# EAGLE design omni-ultra-l1 (EAGLE 9.1.3)
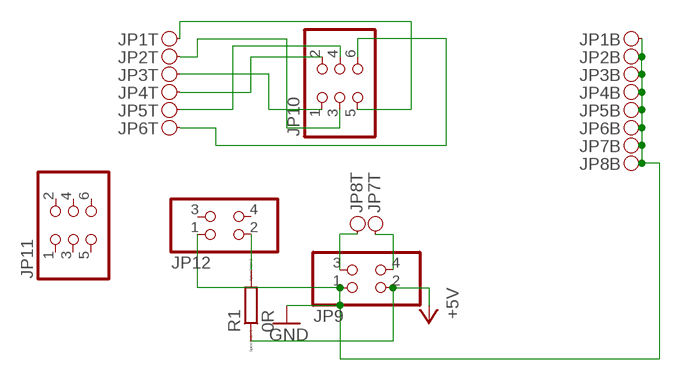
[diagram p0: schematic, sheet 1]

## Parts
JP1  PINH2X01  [PINH2X01SMD]
JP2  PINH2X01  [PINH2X01SMD]
JP3  PINH2X01  [PINH2X01SMD]
JP4  PINH2X01  [PINH2X01SMD]
JP5  PINH2X01  [PINH2X01SMD]
JP6  PINH2X01  [PINH2X01SMD]
JP7  PINH2X01  [PINH2X01SMD]
JP8  PINH2X01  [PINH2X01SMD]
JP9  PINHD-2X2  [2X02]
JP10  PINHD-2X3  [2X03]
JP11  PINHD-2X3  [2X03]
JP12  PINHD-2X2  [2X02]
R1  0R  RR1206  [R1206]

## Nets
+5V: JP9.2 R1.1
GND: JP1.B1 JP2.B1 JP3.B1 JP4.B1 JP5.B1 JP6.B1 JP7.B1 JP8.B1 JP9.1 JP12.1
N$1: JP3.T1 JP10.1
N$2: JP2.T1 JP10.3
N$3: JP12.2 R1.2
N$4: JP4.T1 JP10.2
N$5: JP5.T1 JP10.4
N$6: JP6.T1 JP10.6
N$7: JP8.T1 JP9.3
N$8: JP7.T1 JP9.4
N$9: JP1.T1 JP10.5
Unconnected: JP11.1 JP11.2 JP11.3 JP11.4 JP11.5 JP11.6 JP12.3 JP12.4

## Library data of the parts
JP1-JP8 = pinhead_smd:PINH2X01
JP9 JP12 = pinhead:PINHD-2X2: PIN HEADER
JP10 JP11 = pinhead:PINHD-2X3: PIN HEADER
R1 = eagle-ltspice:R: RESISTOR, European symbol; SPICEMODEL: NONE; SPICEPREFIX: R

## Board
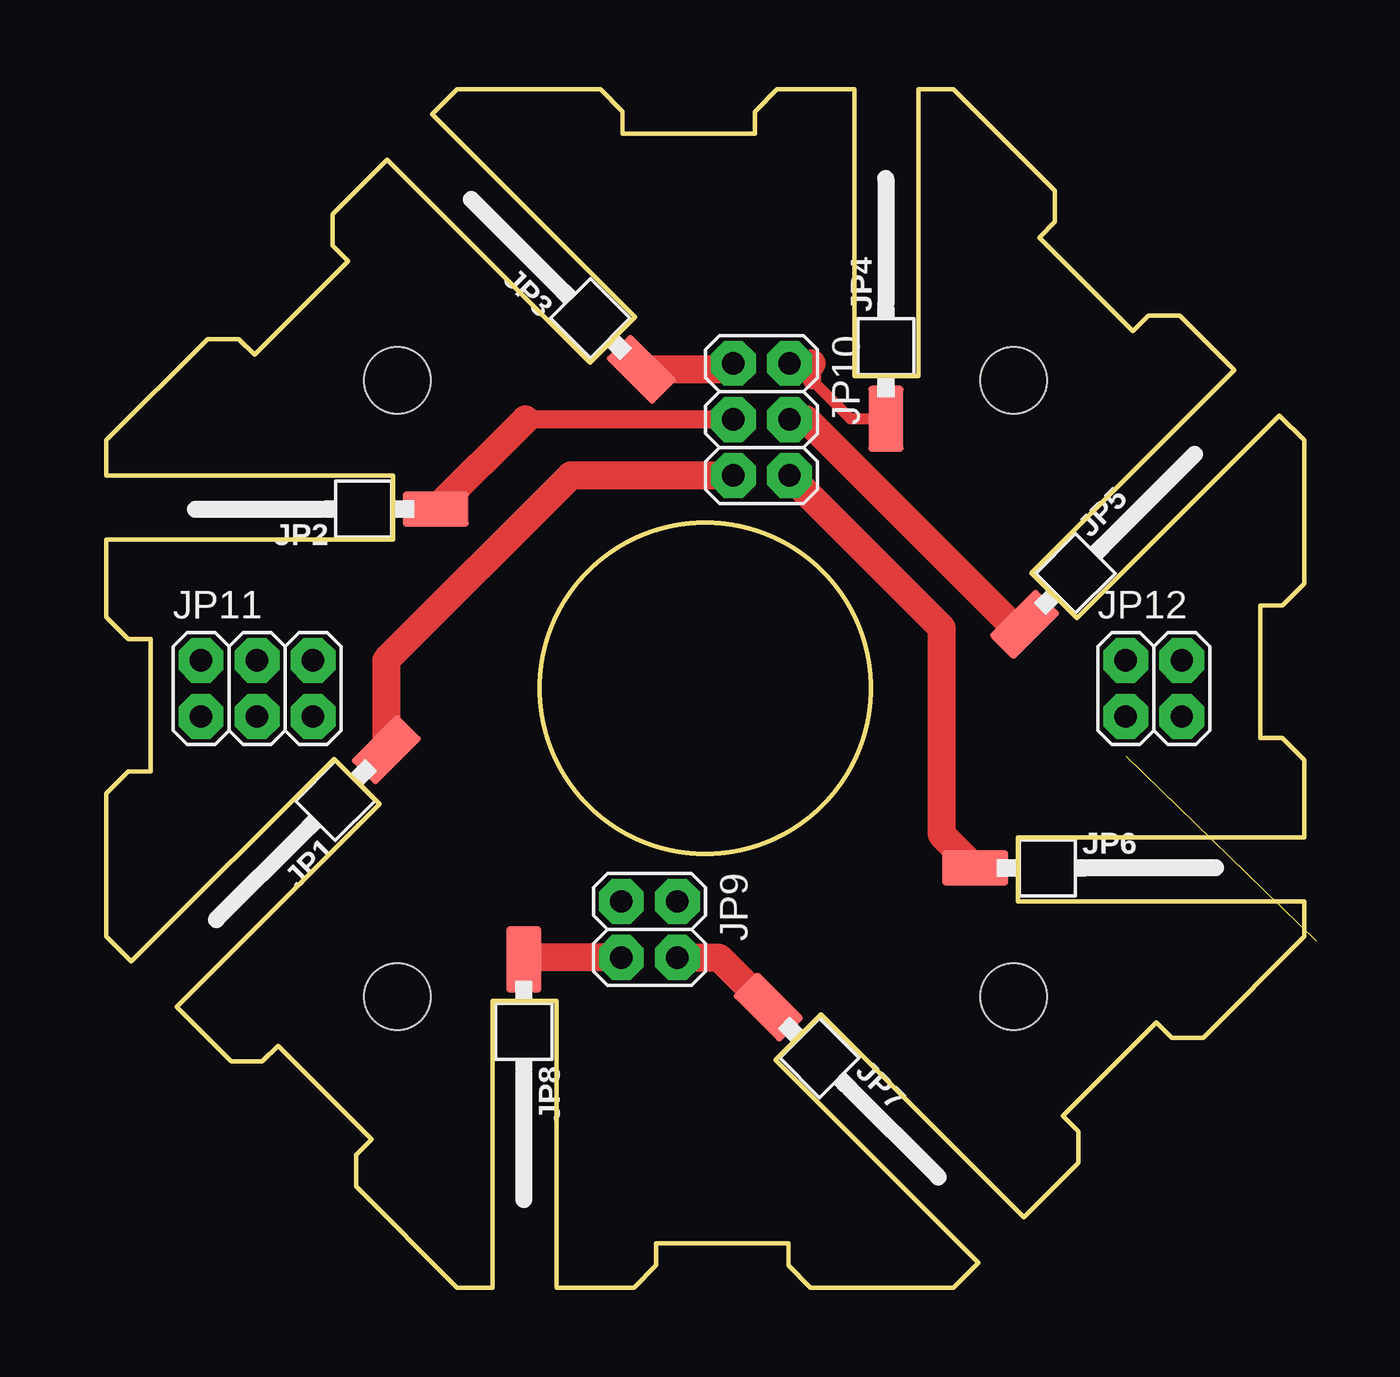
[diagram p1: board, top side]
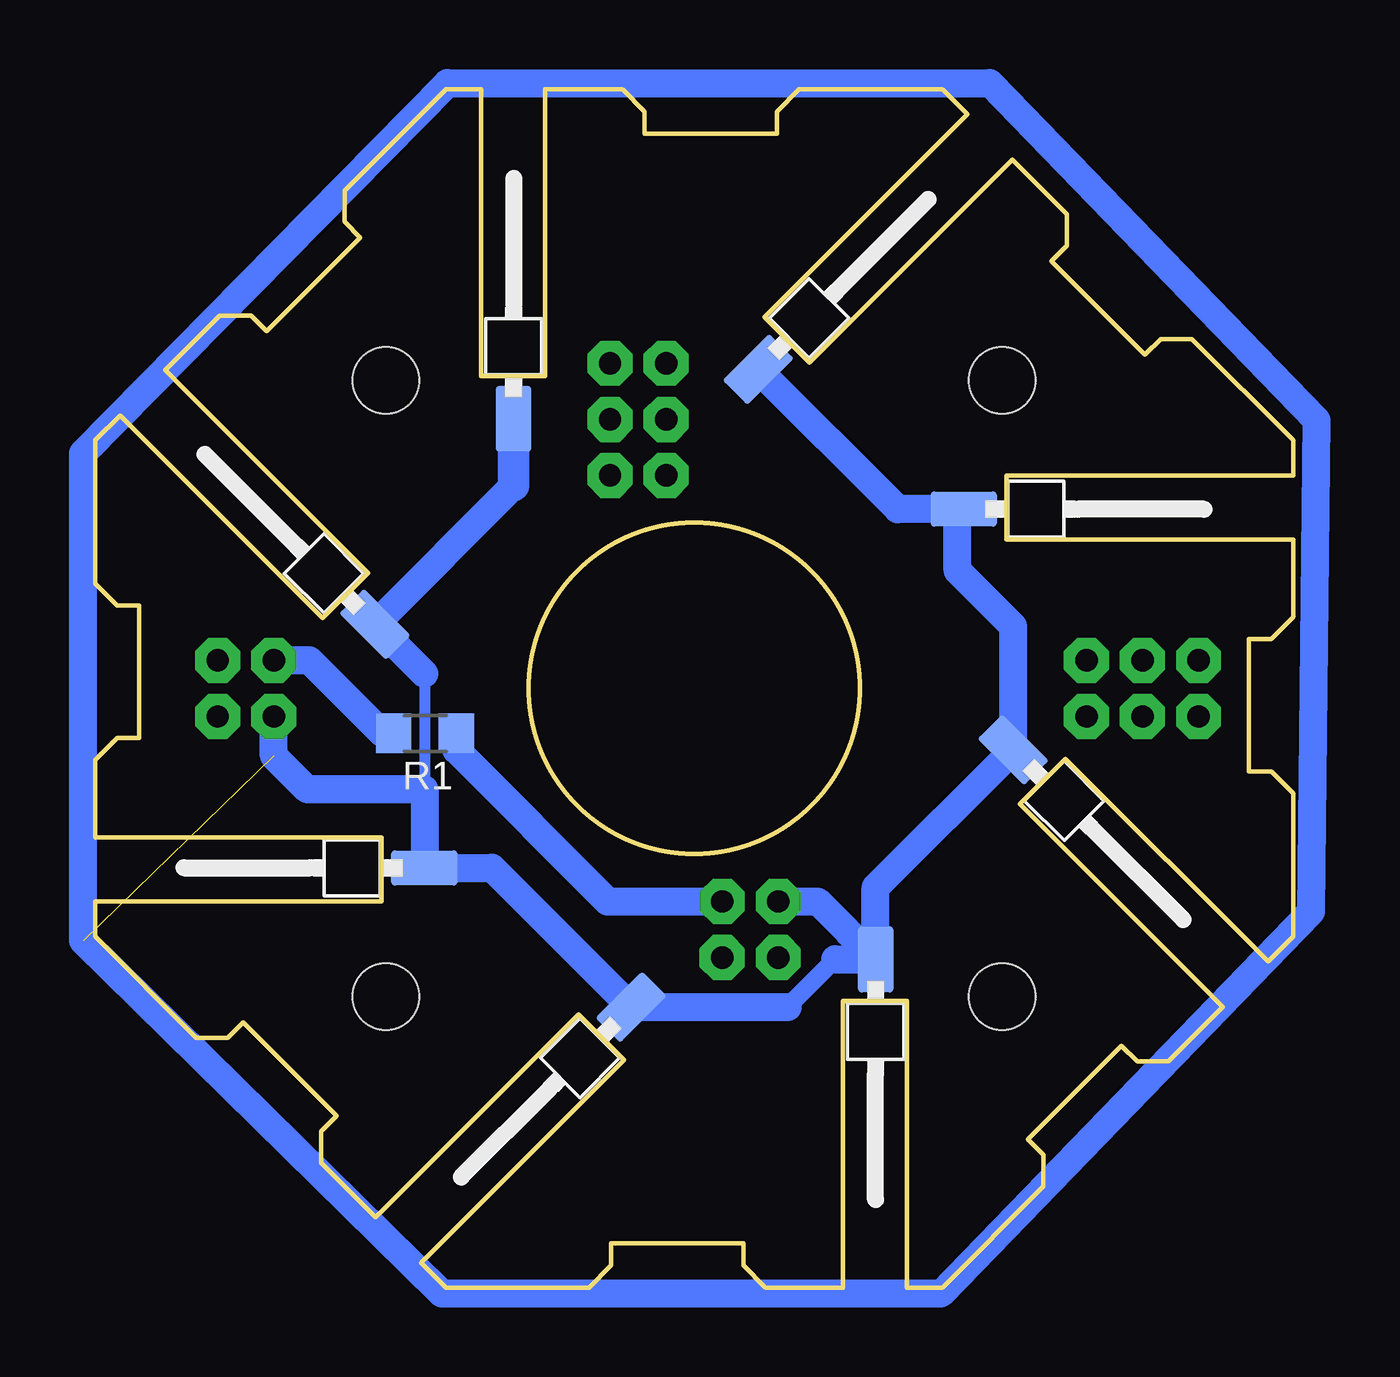
[diagram p2: board, bottom side, seen from below]

Size 54.3 x 54.3 mm. Coordinates in mm from the lower left corner, seen from the top.
Outline: 12.02,6.71 11.31,6 11.31,4.59 15.9,0 17.5,0 17.5,13 20.4,13 20.4,0 23.9,0 24.9,1 24.9,2 30.9,2 30.9,1 31.9,0 38.4,0 39.53,1.13 30.33,10.32 32.38,12.37 41.58,3.18 44.05,5.66 44.05,7.07 43.35,7.78 47.59,12.02 48.3,11.31 49.71,11.31 54.3,15.9 54.3,17.5 41.3,17.5 41.3,20.4 54.3,20.4 54.3,23.9 53.3,24.9 52.3,24.9 52.3,30.9 53.3,30.9 54.3,31.9 54.3,38.4 53.17,39.53 43.98,30.33 41.93,32.38 51.12,41.58 48.64,44.05 47.23,44.05 46.52,43.35 42.28,47.59 42.99,48.3 42.99,49.71 38.4,54.3 36.8,54.3 36.8,41.3 33.9,41.3 33.9,54.3 30.4,54.3 29.4,53.3 29.4,52.3 23.4,52.3 23.4,53.3 22.4,54.3 15.9,54.3 14.77,53.17 23.96,43.98 21.91,41.93 12.72,51.12 10.25,48.64 10.25,47.23 10.95,46.52 6.71,42.28 6,42.99 4.59,42.99 0,38.4 0,36.8 13,36.8 13,33.9 0,33.9 0,30.4 1,29.4 2,29.4 2,23.4 1,23.4 0,22.4 0,15.9 1.13,14.77 10.32,23.96 12.37,21.91 3.18,12.72 5.66,10.25 7.07,10.25 7.78,10.95 12.02,6.71
Outline: circle at 27.15,27.15 radius 7.5
Copper layers (1*16): Top 0.035mm / dielectric 1.5mm / Bottom 0.035mm
Design rules "rucni": minimum track width 10mil, minimum drill 0.8mm, track to track 10mil, track to pad 10mil, pad to pad 10mil, via to via 10mil, smd to smd 10mil, copper to edge 40mil, drill to drill 10mil, minimum pad ring 10mil, minimum via ring 8mil, stop-mask expansion 4mil, vias tented up to drill 0mil, thermal gap 10mil
Holes 3 mm at 13.18,41.12 41.12,41.12 41.12,13.18 13.18,13.18

### Footprints (pad centres in the part's own frame; a part is rotated, then mirrored left to right if it is on the bottom)
PINH2X01SMD = smd 1.6 x 3 bottom: B1 0,-2 | smd 1.6 x 3: T1 0,-2
2X02 = drill 1.016 octagon: 1 -1.27,-1.27; 2 -1.27,1.27; 3 1.27,-1.27; 4 1.27,1.27
2X03 = drill 1.016 octagon: 1 -2.54,-1.27; 2 -2.54,1.27; 3 0,-1.27; 4 0,1.27; 5 2.54,-1.27; 6 2.54,1.27
R1206 = smd 1.6 x 1.803: 1 -1.422,0; 2 1.422,0

### Placement (x,y rotation side)
JP1  11.27,22.96 135 top
JP2  12.93,35.28 90 top
JP3  22.83,43.02 45 top
JP4  35.33,41.37 0 top
JP5  43.02,31.47 315 top
JP6  41.37,19.02 270 top
JP7  31.42,11.3 225 top
JP8  18.92,12.88 180 top
JP9  24.61,16.23 270 top
JP10  29.69,39.34 270 top
JP11  6.83,27.15 0 top
JP12  47.47,27.15 0 top
R1  39.34,25.12 180 bottom

### Tracks (layer width: path | path; a pad name or v marks a point on that pad's centre or on a via)
+5V
  Bottom 1.27: JP9.2 31.06,17.5 37.92,24.36 R1.1
GND  (1 unrouted)
  Bottom 0.508: 15.21,34.99 JP2.B1 | 39.37,27.82 39.37,22.58
  Bottom 0.813: 22.92,12.71 20.76,14.87
  Bottom 1.27: JP9.1 21.54,17.5 JP8.B1 | JP8.B1 18.92,18.14 JP1.B1 12.69,29.96 15.21,32.48 15.21,34.99 | JP2.B1 17.91,35.28 JP3.B1 | 35.33,36.34 JP5.B1 39.37,27.82 | 22.92,12.71 JP7.B1 36.31,19.02 JP6.B1 39.37,22.58 44.68,22.58 46.2,24.1 JP12.1 | 20.76,14.87 JP8.B1 | -1.05,39.3 -0.91,27.15 -0.8,17.03 15.97,-0.28 38.58,-0.28 54.84,15.72 54.84,37.82 38.33,54.58 13.74,54.58 -1.05,39.3
  Bottom 1.422: JP4.B1 35.33,36.34
N$1
  Top 0.508: JP10.1 28.15,41.61
  Top 1.27: 28.15,41.61 JP3.T1
N$2
  Top 0.813: JP10.3 18.99,39.34
  Top 1.27: 18.99,39.34 JP2.T1
N$3
  Bottom 1.27: JP12.2 44.57,28.42 41.27,25.12 R1.2
N$4
  Top 0.508: JP4.T1 33.72,39.37 31.98,41.12
  Top 0.813: 31.98,41.88 31.98,41.12
  Top 1.27: JP10.2 31.98,41.88
N$5
  Top 0.508: 41.01,30.05 JP5.T1
  Top 1.27: JP10.4 31.72,39.34 41.01,30.05
N$6
  Top 1.27: JP10.6 37.85,29.91 37.85,20.55 JP6.T1
N$7
  Top 0.508: 19,14.96 JP8.T1
  Top 1.27: JP9.3 19,14.96
N$8
  Top 1.27: JP9.4 27.76,14.96 JP7.T1
N$9
  Top 1.27: JP10.5 21.05,36.8 12.69,28.44 JP1.T1